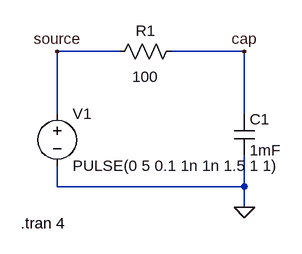
[diagram p0: schematic electronics_pulse_into_cap.asc]
electronics_pulse_into_cap.asc, the LTspice schematic file:
Version 4
SHEET 1 880 680
WIRE 128 16 32 16
WIRE 320 16 208 16
WIRE 32 112 32 16
WIRE 320 112 320 16
WIRE 32 224 32 192
WIRE 320 224 320 176
WIRE 320 224 32 224
WIRE 320 256 320 224
FLAG 320 256 0
FLAG 32 16 source
FLAG 320 16 cap
SYMBOL voltage 32 96 R0
WINDOW 123 0 0 Left 0
WINDOW 39 0 0 Left 0
SYMATTR InstName V1
SYMATTR Value PULSE(0 5 0.1 1n 1n 1.5 1 1)
SYMBOL cap 304 112 R0
SYMATTR InstName C1
SYMATTR Value 1mF
SYMBOL res 112 32 R270
WINDOW 0 32 56 VTop 2
WINDOW 3 -7 56 VBottom 2
SYMATTR InstName R1
SYMATTR Value 100
TEXT -24 280 Left 2 !.tran 4

The netlist it stands for:
* electronics_pulse_into_cap.asc
V1 source 0 PULSE(0 5 0.1 1n 1n 1.5 1 1)
C1 cap 0 1mF
R1 source cap 100
.tran 4
.backanno
.end

* Results of the author's LTspice run, read from the files saved beside the schematic
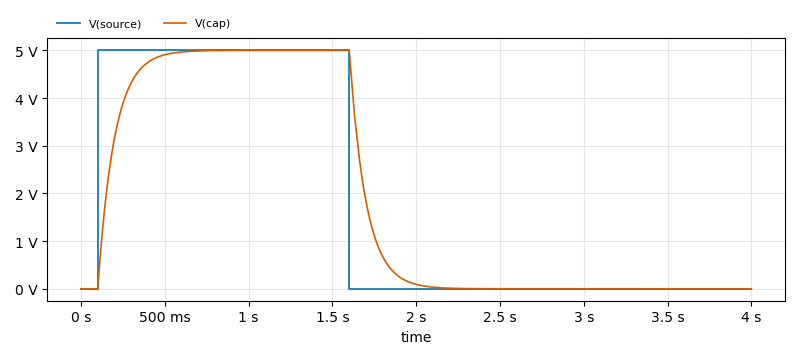
[diagram p1: Transient Analysis of electronics_pulse_into_cap.asc, plotted from the saved traces]
* Transient Analysis, 1 run:
*   V(source): min 0 V, max 5 V, average 1.875 V, rms 3.062 V, last 0 V
*   V(cap): min 0 V, max 5 V, average 1.875 V, rms 2.959 V, last 0 V